# Altium schematic sheet MCU.SchDoc
size A4; DocumentNumber: 3; SheetNumber: 3; SheetTotal: 4
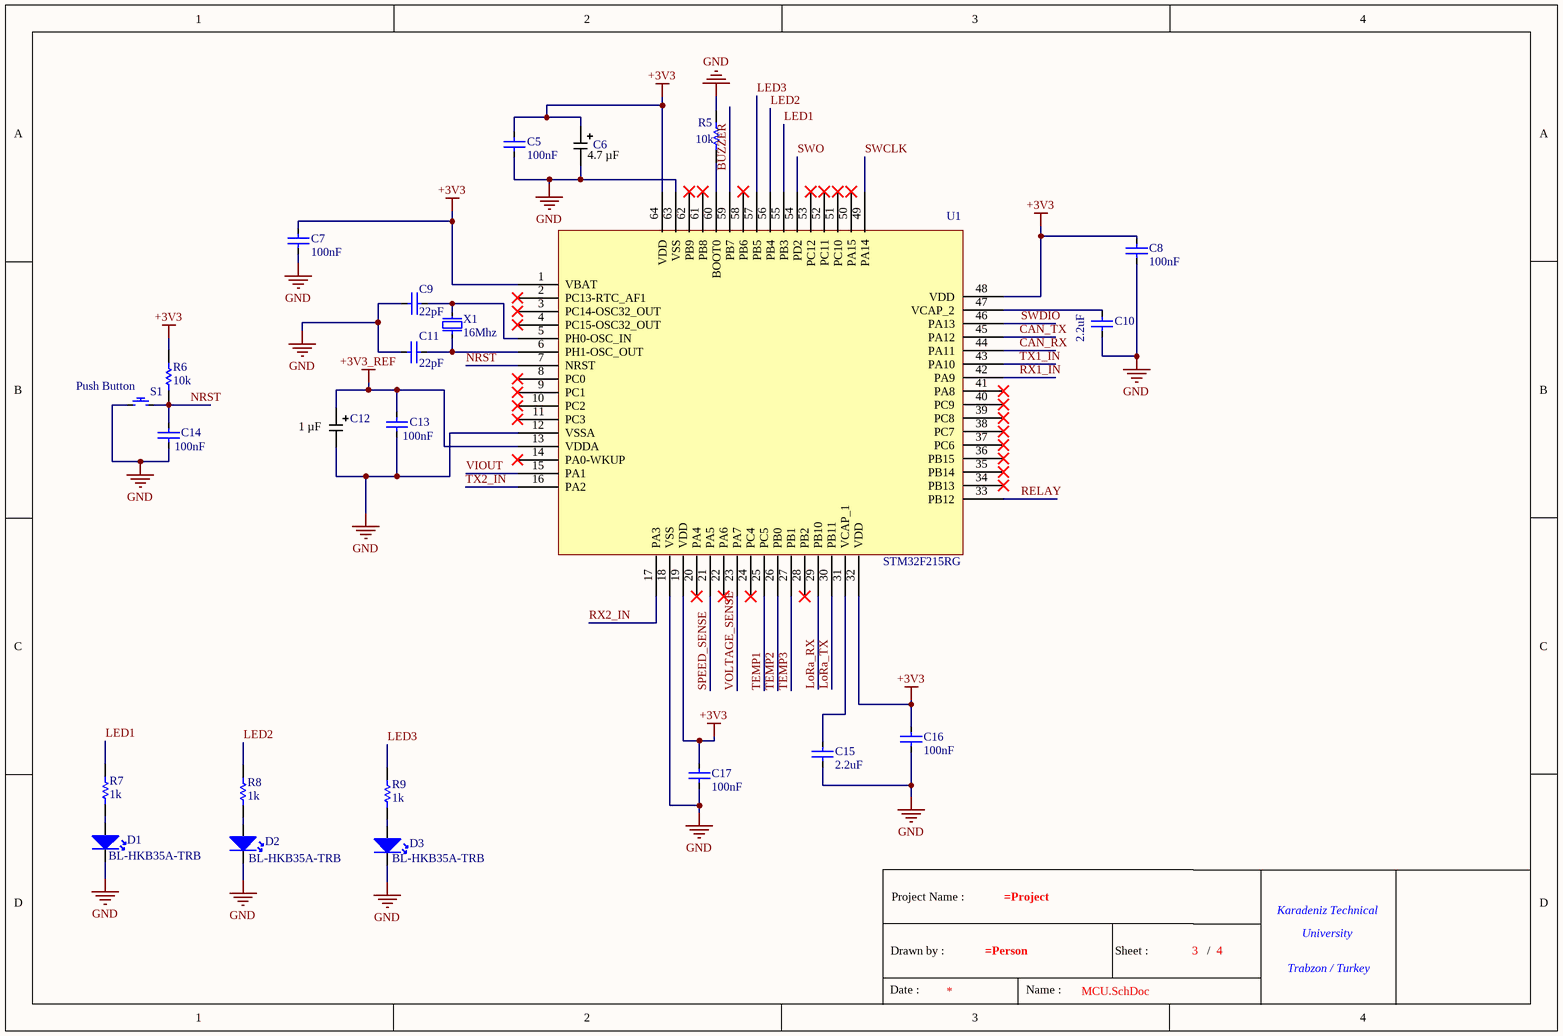
[diagram p0: MCU.SchDoc]

## Parts
*  Title Block  (value not drawn)  (graphical)
C5  100nF  [CAP-0603]
C6  Capacitance: 4.7 µF  [KEMET_CAP_TAN-B]  (hidden comment: T491B475K016AT)
C7  100nF  [CAP-0603]
C8  100nF  [CAP-0603]
C9  22pF  [CAP-0805]
C10  2.2uF  [CAP-0805]
C11  22pF  [CAP-0805]
C12  Capacitance: 1 µF  [KEMET_CAP_TAN-B]  (hidden comment: T491B105K025AT)
C13  100nF  [CAP-0603]
C14  100nF  [CAP-0603]
C15  2.2uF  [CAP-0805]
C16  100nF  [CAP-0603]
C17  100nF  [CAP-0603]
D1  BL-HKB35A-TRB  [LED-0805]
D2  BL-HKB35A-TRB  [LED-0805]
D3  BL-HKB35A-TRB  [LED-0805]
R5  10k  [RES-0603]
R6  10k  [RES-0603]
R7  1k  [RES-0603]
R8  1k  [RES-0603]
R9  1k  [RES-0603]
S1  Push Button  [2.54mm_Push Button]  (no BOM)
U1  STM32F215RG  [LQFP64]
X1  16Mhz  [OSC-THT (11.5*5.00*3.60)]

## Nets
+3V3: C5.2 C6.1 C7.2 C8.2 C16.2 C17.2 R6.1 U1.1(VBAT) U1.19(VDD) U1.32(VDD) U1.48(VDD) U1.64(VDD)
+3V3_REF: C12.1 C13.2 U1.13(VDDA)
GND: C5.1 C6.2 C7.1 C8.1 C9.2 C10.1 C11.1 C12.2 C13.1 C14.1 C15.1 C16.1 C17.1 D1.2(K) D2.2(K) D3.2(K) R5.2 S1.1 U1.12(VSSA) U1.18(VSS) U1.63(VSS)
BUZZER: U1.59(PB7)
CAN_RX: U1.44(PA11)
CAN_TX: U1.45(PA12)
LED1: R7.1 U1.55(PB3)
LED2: R8.1 U1.56(PB4)
LED3: R9.1 U1.57(PB5)
LoRa_RX: U1.29(PB10)
LoRa_TX: U1.30(PB11)
NRST: C14.2 R6.2 S1.2 U1.7(NRST)
RELAY: U1.33(PB12)
RX1_IN: U1.42(PA9)
RX2_IN: U1.17(PA3)
SPEED_SENSE: U1.21(PA5)
SWCLK: U1.49(PA14)
SWDIO: U1.46(PA13)
SWO: U1.54(PD2)
TEMP1: U1.25(PC5)
TEMP2: U1.26(PB0)
TEMP3: U1.27(PB1)
TX1_IN: U1.43(PA10)
TX2_IN: U1.16(PA2)
VIOUT: U1.15(PA1)
VOLTAGE_SENSE: U1.23(PA7)
NetC9_1: C9.1 U1.5(PH0-OSC_IN) X1.2
NetC10_2: C10.2 U1.47(VCAP_2)
NetC11_2: C11.2 U1.6(PH1-OSC_OUT) X1.1
NetC15_2: C15.2 U1.31(VCAP_1)
NetD1_1: D1.1(A) R7.2
NetD2_1: D2.1(A) R8.2
NetD3_1: D3.1(A) R9.2
NetR5_1: R5.1 U1.60(BOOT0)

Not connected (* = marked no-connect by the designer): U1 2(PC13-RTC_AF1)* 3(PC14-OSC32_OUT)* 4(PC15-OSC32_OUT)* 8(PC0)* 9(PC1)* 10(PC2)* 11(PC3)* 14(PA0-WKUP)* 20(PA4)* 22(PA6)* 24(PC4)* 28(PB2)* 34(PB13)* 35(PB14)* 36(PB15)* 37(PC6)* 38(PC7)* 39(PC8)* 40(PC9)* 41(PA8)* 50(PA15)* 51(PC10)* 52(PC11)* 53(PC12)* 58(PB6)* 61(PB8)* 62(PB9)*

## Notes on the sheet
- (in symbol Title Block) Project Name :; Karadeniz Technical; University; Drawn by :; Sheet :; /; Trabzon / Turkey; Date :; Name :

## Library data of the parts
* = Title Block: Standart Title Block
C5 C7 C8 C13 C14 C16 C17 = CGA3E2X7R1H104K080AA: Manufacturer: TDK; Temperature Coefficient: X7R; Voltage: 50V; Library Reference: Capacitor; Tolerance: %10; Man Code: CGA3E2X7R1H104K080AA; Value: 100nF; Footprint: 0603; Component Type: Ceramic Capacitor
C6 = T491B475K016AT: CAP TANT 4.7UF 10% 16V 1411; Manufacturer: KEMET; Manufacturer Size Code: B; Type: Molded; ESR (Equivalent Series Resistance): 3.5 Ohm; Lifetime @ Temp.: 2000 Hrs @ 125°C; Series: T491; Package: Tape & Reel (TR); Tolerance: ±10%; Operating Temperature: -55°C ~ 125°C; Mounting Type: Surface Mount; Package / Case: 1411 (3528 Metric); Size / Dimension: 0.138" L x 0.110" W (3.50mm x 2.80mm); Height - Seated (Max): 0.083" (2.10mm); Lead Spacing: -; Ratings: -; Features: General Purpose; Failure Rate: -; Voltage - Rated: 16 V; Ozdisan Link: https://ozdisan.com/pasif-komponentler/kondansatorler/tantal-kondansatorler/T491B475K016AT; Digikey Link: https://www.digikey.com/en/products/detail/kemet/T491B475K016AT/818582; Farnell TR Link: https://tr.farnell.com/kemet/t491b475k016at/cap-4-7-f-16v-10-smd/dp/1457453?st=t491b475k016at; Mouser Link: https://www.mouser.com.tr/ProductDetail/KEMET/T491B475K016AT?qs=pWsseJt92L15yATvg%252BRzxw%3D%3D
C9 C11 = CL21C220JBANNNC: Manufacturer: Samsung Electro-Mechanics; Temperature Coefficient: C0G; Voltage: 50V; Library Reference: Capacitor; Tolerance: %5; Man Code: CL21C220JBANNNC; Value: 22pF; Footprint: 0805; Component Type: Ceramic Capacitor
C10 C15 = CL21B225KAFVPNE_1: Manufacturer: Samsung Electro-Mechanics; Library Reference: Capacitor; Temperature Coefficient: X7R; Tolerance: %10; Voltage: 25V; Component Type: Ceramic Capacitor; Footprint: 0805; Man Code: CL21B225KAFVPNE; Value: 2.2uF
C12 = T491B105K025AT: CAP TANT 1UF 10% 25V 1411; Manufacturer: KEMET; Manufacturer Size Code: B; Type: Molded; ESR (Equivalent Series Resistance): 5 Ohm; Lifetime @ Temp.: 2000 Hrs @ 125°C; Series: T491; Package: Tape & Reel (TR); Tolerance: ±10%; Operating Temperature: -55°C ~ 125°C; Mounting Type: Surface Mount; Package / Case: 1411 (3528 Metric); Size / Dimension: 0.138" L x 0.110" W (3.50mm x 2.80mm); Height - Seated (Max): 0.083" (2.10mm); Lead Spacing: -; Ratings: -; Features: General Purpose; Failure Rate: -; Voltage - Rated: 25 V; Ozdisan Link: https://ozdisan.com/pasif-komponentler/kondansatorler/tantal-kondansatorler/T491B105K025AT; Digikey Link: https://www.digikey.com/en/products/detail/kemet/T491B105K025AT/3724810; Farnell TR Link: https://tr.farnell.com/kemet/t491b105k025at/cap-1-f-25v-10/dp/2321211?st=t491b105k025at; Mouser Link: https://www.mouser.com.tr/ProductDetail/KEMET/T491B105K025AT?qs=MSnLt6VizIVP1rbCgJ%252B8hw%3D%3D
D1-D3 = BL-HKB35A-TRB: Manufacturer: BRIGHT LED; Colour: Yellow; Vf: 2.2V; Library Reference: Miscellaneous; Luminous Intensity: 94mcd; If: 20mA; Lens Transparency: Water Clear; Man Code: BL-HKB35A-TRB; Footprint: 0805; Component Type: Led
R5 R6 = CRCW060310K0FKEA: Manufacturer: Vishay; Tolerance: %1; Power: 0.1W; Library Reference: Resistor; Man Code: CRCW060310K0FKEA; Value: 10k; Footprint: 0603; Component Type: Chip Resistor
R7-R9 = CRCW06031K00FKEAC: Manufacturer: Vishay; Library Reference: Resistor; Tolerance: %1; Power: 0.1W; Man Code: CRCW06031K00FKEAC; Footprint: 0603; Component Type: Chip Resistor; Value: 1k
S1 = Push Button: Library Reference: Other Switches; Component Type: Push Button
U1 = STM32F215RG: Manufacturer: STM; Speed: 120 mHz; Program Memory Size: 1 MB; Supply Voltage: 1.8V-3.6V; Number of Bits: 32; Number of I/O: 51; Component Type: Microcontroller; Man Code: STM32F215RG
X1 = AS49S-16M-FC160F3: Manufacturer: ANSEN; Frequency Tolerance: 20ppm; Frequency Stability: 50ppm; Library Reference: Miscellaneous; Capacitance: 16pF; ESR: 30ohm; Man Code: AS49S-16M-FC160F3; Value: 16Mhz; Component Type: Crystal Oscillator; Footprint: THT (11.5*5.00*3.60)